# EAGLE schematic MotorSürücü (EAGLE 9.6.2)
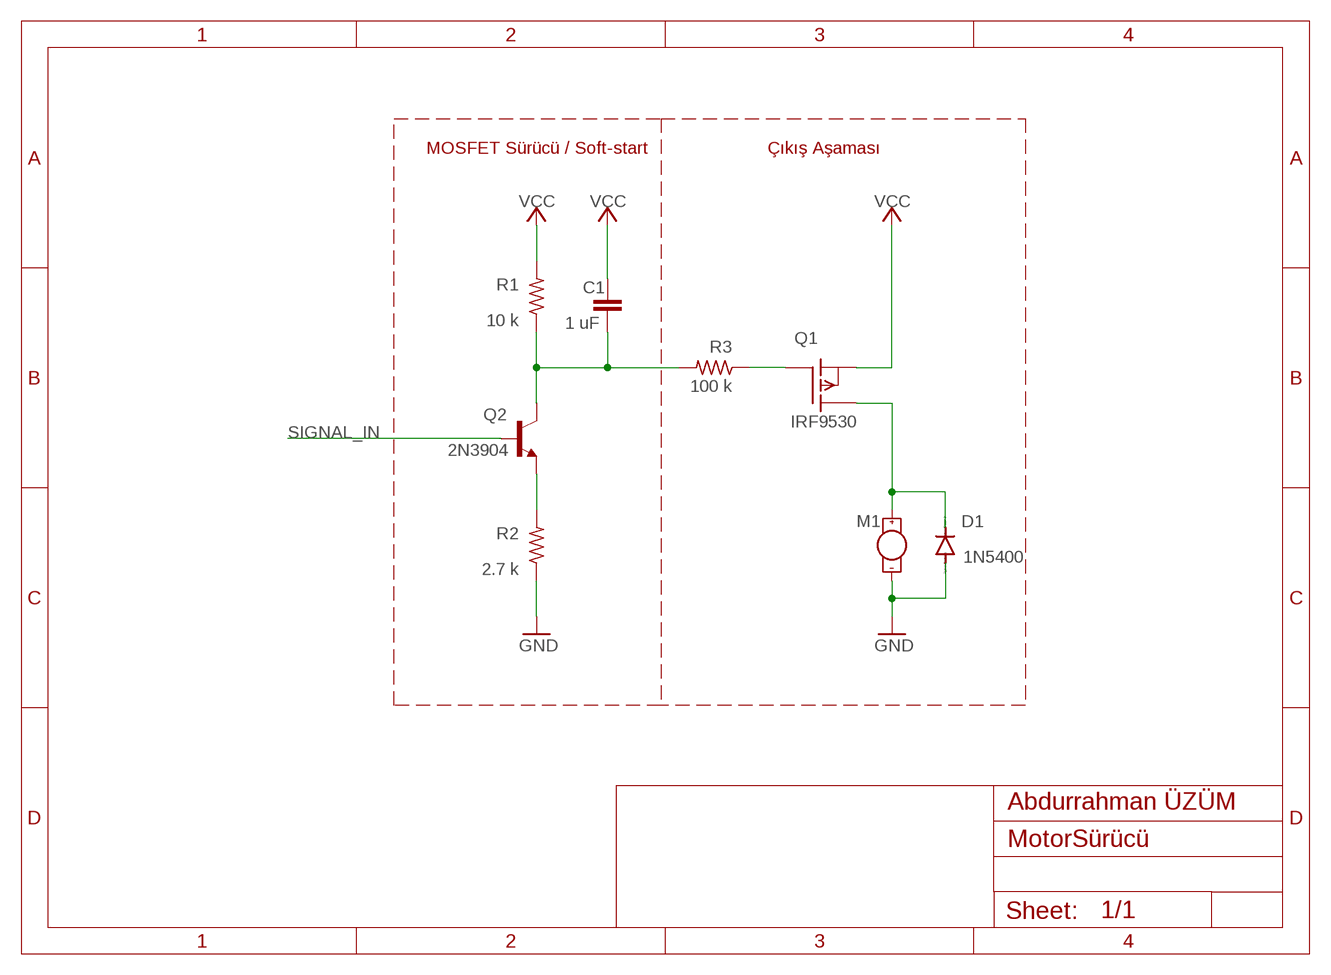
[diagram p0: schematic, sheet 1]

## Parts
C1  1 uF  C-EU025-025X050  [C025-025X050]
D1  1N5400  [DO201-15]
M1  MOTOR10MM  [VIBE-MOTOR-10MM]
Q1  IRF9530  [TO220]
Q2  2N3904  [TO92]
R1  10 k  R-US_0204/7  [0204/7]
R2  2.7 k  R-US_0204/7  [0204/7]
R3  100 k  R-US_0204/7  [0204/7]

## Nets
GND: D1.A M1.- R2.1
N$1: C1.2 Q2.1(C) R1.1 R3.2
N$2: Q2.3(E) R2.2
N$4: Q1.1(G) R3.1
N$5: D1.C M1.+ Q1.2(D)
SIGNAL_IN: Q2.2(B)
VCC: C1.1 Q1.3(S) R1.2

## Notes on the sheet
- MOSFET Sürücü / Soft-start | Çıkış Aşaması
- Abdurrahman ÜZÜM

## Library data of the parts
C1 = rcl:C-EU: CAPACITOR, European symbol; SPICEPREFIX: C
D1 = diode:1N5400: DIODE standard rectifier, 3 A, 50 V (Motorola)
M1 = SparkFun-Electromechanical:MOTOR: Motor (Single-Phase) Two-terminal, single-phase motors. SparkFun Products Vibration Motor <https://www.sparkfun.com/products/8449> (ROB-08449) Physical dimension and wire connections for this powerful vibration motor. Motor has a self adhesive backing.; PROD_ID: COMP-08572; SF_SKU: ROB-08449
Q1 = transistor-fet:IRF9530: P-Channel Enhancement MOSFET (HEXFET); -100V; -12A; 0,3Ohm
Q2 = transistor:2N3904: NPN TRANSISTOR
R1-R3 = rcl:R-US_: RESISTOR, American symbol; SPICEPREFIX: R